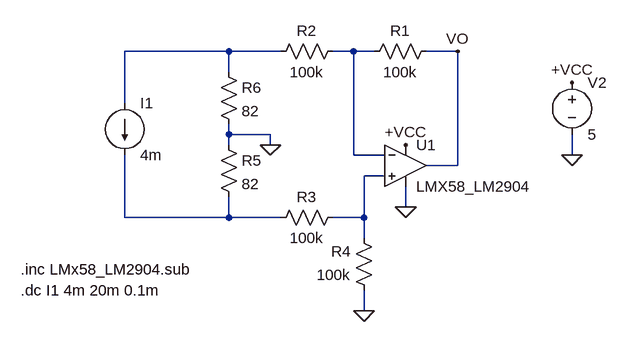
[diagram p0: schematic Buffer.asc]
Buffer.asc, the LTspice schematic file:
Version 4
SHEET 1 880 680
WIRE -48 16 -208 16
WIRE 32 16 -48 16
WIRE 144 16 112 16
WIRE 176 16 144 16
WIRE 304 16 256 16
WIRE -48 48 -48 16
WIRE -208 96 -208 16
WIRE -48 144 -48 128
WIRE 16 144 -48 144
WIRE -48 160 -48 144
WIRE 16 160 16 144
WIRE 144 176 144 16
WIRE 192 176 144 176
WIRE 480 176 480 144
WIRE 304 192 304 16
WIRE 304 192 256 192
WIRE 192 208 160 208
WIRE 224 256 224 224
WIRE -208 272 -208 176
WIRE -48 272 -48 240
WIRE -48 272 -208 272
WIRE 32 272 -48 272
WIRE 160 272 160 208
WIRE 160 272 112 272
WIRE 160 304 160 272
WIRE 160 416 160 384
FLAG 480 64 +VCC
FLAG 224 160 +VCC
FLAG 304 16 VO
FLAG 224 256 0
FLAG 480 176 0
FLAG 16 160 0
FLAG 160 416 0
SYMBOL res 272 0 R90
WINDOW 0 0 56 VBottom 2
WINDOW 3 32 56 VTop 2
SYMATTR InstName R1
SYMATTR Value 100k
SYMBOL res 128 0 R90
WINDOW 0 0 56 VBottom 2
WINDOW 3 32 56 VTop 2
SYMATTR InstName R2
SYMATTR Value 100k
SYMBOL res 128 256 R90
WINDOW 0 0 56 VBottom 2
WINDOW 3 32 56 VTop 2
SYMATTR InstName R3
SYMATTR Value 100k
SYMBOL res 176 400 R180
WINDOW 0 36 76 Left 2
WINDOW 3 36 40 Left 2
SYMATTR InstName R4
SYMATTR Value 100k
SYMBOL OpAmps\\opamp2 224 128 R0
SYMATTR InstName U1
SYMATTR Value LMX58_LM2904
SYMBOL voltage 480 48 R0
WINDOW 123 0 0 Left 0
WINDOW 39 0 0 Left 0
SYMATTR InstName V2
SYMATTR Value 5
SYMBOL res -64 144 R0
SYMATTR InstName R5
SYMATTR Value 82
SYMBOL res -64 32 R0
SYMATTR InstName R6
SYMATTR Value 82
SYMBOL current -208 96 R0
WINDOW 123 0 0 Left 0
WINDOW 39 0 0 Left 0
SYMATTR InstName I1
SYMATTR Value 4m
TEXT -368 352 Left 2 !.inc LMx58_LM2904.sub
TEXT -368 384 Left 2 !.dc I1 4m 20m 0.1m

The netlist it stands for:
* Buffer.asc
R1 VO N002 100k
R2 N002 N001 100k
R3 N003 N004 100k
R4 0 N003 100k
XU1 N003 N002 +VCC 0 VO LMX58_LM2904  ; pins In+ In- V+ V- OUT
V2 +VCC 0 5
R5 0 N004 82
R6 N001 0 82
I1 N001 N004 4m
.inc LMx58_LM2904.sub
.dc I1 4m 20m 0.1m
.backanno
.end